# Altium schematic sheet Power_Regulators_Digital_4.SchDoc
size A4; DocumentNumber: 33; SheetNumber: 33; SheetTotal: 47
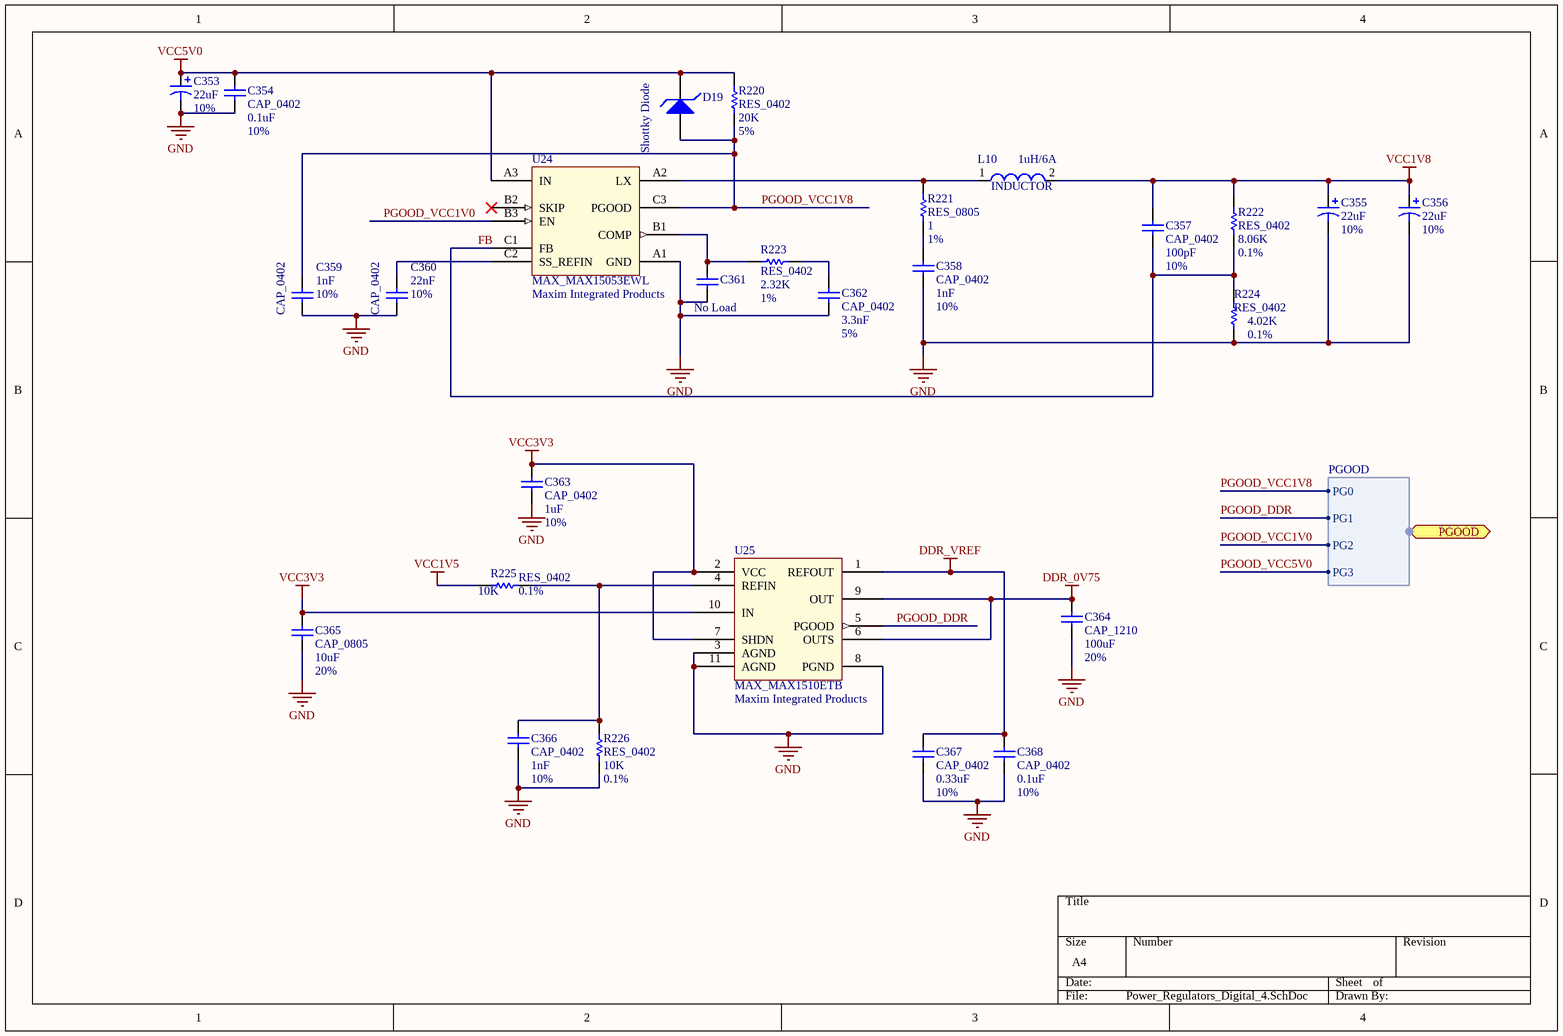
[diagram p0: Power_Regulators_Digital_4.SchDoc]

## Parts
C353  value 22uF  Tolerance: 10%  [Polarized_CAPC1210(3225)]  (hidden comment: Cap Pol1)
C354  CAP_0402  value 0.1uF  Tolerance: 10%  [CAPC0402(1005)60_N]
C355  value 22uF  Tolerance: 10%  [Polarized_CAPC1210(3225)]  (hidden comment: Cap Pol1)
C356  value 22uF  Tolerance: 10%  [Polarized_CAPC1210(3225)]  (hidden comment: Cap Pol1)
C357  CAP_0402  value 100pF  Tolerance: 10%  [CAPC0402(1005)60_N]
C358  CAP_0402  value 1nF  Tolerance: 10%  [CAPC0402(1005)60_N]
C359  CAP_0402  value 1nF  Tolerance: 10%  [CAPC0402(1005)60_N]
C360  CAP_0402  value 22nF  Tolerance: 10%  [CAPC0402(1005)60_N]
C361  value No Load  [CAPC0201(0603)33_N]  (hidden comment: CAP_0201)
C362  CAP_0402  value 3.3nF  Tolerance: 5%  [CAPC0402(1005)60_N]
C363  CAP_0402  value 1uF  Tolerance: 10%  [CAPC0402(1005)60_N]
C364  CAP_1210  value 100uF  Tolerance: 20%  [CAPC1210(3225)100_N]
C365  CAP_0805  value 10uF  Tolerance: 20%  [CAPC0805(2012)75_N]
C366  CAP_0402  value 1nF  Tolerance: 10%  [CAPC0402(1005)60_N]
C367  CAP_0402  value 0.33uF  Tolerance: 10%  [CAPC0402(1005)60_N]
C368  CAP_0402  value 0.1uF  Tolerance: 10%  [CAPC0402(1005)60_N]
D19  Shottky Diode  [SchottkyDiode_RB751S40_2-PIN]
L10  INDUCTOR  value 1uH/6A  [Inductor_SRN6045-Series_2-PIN]
R220  RES_0402  value 20K  Tolerance: 5%  [RESC0402(1005)_N]
R221  RES_0805  value 1  Tolerance: 1%  [RESC0805(2012)_N]
R222  RES_0402  value 8.06K  Tolerance: 0.1%  [RESC0402(1005)_N]
R223  RES_0402  value 2.32K  Tolerance: 1%  [RESC0402(1005)_N]
R224  RES_0402  value 4.02K  Tolerance: 0.1%  [RESC0402(1005)_N]
R225  RES_0402  value 10K  Tolerance: 0.1%  [RESC0402(1005)_N]
R226  RES_0402  value 10K  Tolerance: 0.1%  [RESC0402(1005)_N]
U24  MAX_MAX15053EWL  Manufacturer: Maxim Integrated Products  [MAX_MAX15053EWL_9WLP_W91E1Z+1]
U25  MAX_MAX1510ETB  Manufacturer: Maxim Integrated Products  [MAX_MAX1510ETB_10TDFN_T1033+1]

## Ports
PGOOD (harness PGOOD)

## Harnesses
PGOOD: PG0, PG1, PG2, PG3

## Nets
DDR_0V75: C364.2 U25.6(OUTS) U25.9(OUT)
DDR_VREF: C367.2 C368.2 U25.1(REFOUT)
GND: C353.2 C354.1 C355.2 C356.2 C358.1 C359.1 C360.1 C361.1 C362.1 C363.1 C364.1 C365.1 C366.1 C367.1 C368.1 R224.1 R226.1 U24.A1(GND) U25.3(AGND) U25.8(PGND) U25.11(AGND)
VCC1V5: R225.1
VCC1V8: C355.1 C356.1 C357.2 L10.2 R222.2
VCC3V3: C363.2 C365.2 U25.2(VCC) U25.7(SHDN) U25.10(IN)
VCC5V0: C353.1 C354.2 D19.1(K) R220.2 U24.A3(IN)
FB: C357.1 R222.1 R224.2 U24.C1(FB)
PGOOD_DDR: U25.5(PGOOD) ; port PGOOD.PG1
PGOOD_VCC1V0: U24.B3(EN) ; port PGOOD.PG2
PGOOD_VCC1V8: C359.2 D19.2(A) R220.1 U24.C3(PGOOD) ; port PGOOD.PG0
PGOOD_VCC5V0: port PGOOD.PG3
NetC358_2: C358.2 R221.1
NetC360_2: C360.2 U24.C2(SS_REFIN)
NetC361_2: C361.2 R223.1 U24.B1(COMP)
NetC362_2: C362.2 R223.2
NetC366_2: C366.2 R225.2 R226.2 U25.4(REFIN)
NetL10_1: L10.1 R221.2 U24.A2(LX)

Not connected (* = marked no-connect by the designer): U24 B2(SKIP)*

## Library data of the parts
C353 C355 C356 = TAJB226K006RNJ: 22uF, tantalum, 10% 6.3V, 1210; Manufacturer: AVX Corporation; Part Number: TAJB226K006RNJ; Footprint Ref: Polarized_CAPC1210(3225); Library Ref: Cap Pol1
C354 C368 = C1005X5R0J104K: 0.1uf, ceramic, 10%, 6.3V, X5R, 0402; Manufacturer: TDK Corporation; Part Number: C1005X5R0J104K; Footprint Ref: CAPC0402(1005)60_N; Library Ref: CAP_0402
C357 = 04026C101KAT2A: 100pF, ceramic, 10% 6.3V X7R, 0402; Manufacturer: AVX Corporation; Part Number: 04026C101KAT2A; Footprint Ref: CAPC0402(1005)60_N; Library Ref: CAP_0402
C358 C359 C366 = ECJ-0EB1E102K: 1000pF, ceramic, 10% 25V X7R, 0402; Manufacturer: Panasonic - ECG; Part Number: ECJ-0EB1E102K; Footprint Ref: CAPC0402(1005)60_N; Library Ref: CAP_0402
C360 = 0402YC223KAT2A: 0.022uF, ceramic, 10%, 16V, X7R, 0402; Manufacturer: AVX Corporation; Part Number: 0402YC223KAT2A; Footprint Ref: CAPC0402(1005)60_N; Library Ref: CAP_0402
C361 = No Load: Generic Capacitor; Tolerance: *; Part Number: No Load; Manufacturer: No Load; Footprint Ref: CAPC0201(0603)33_N; Library Ref: CAP_0201
C362 = LMK105SD332JV-F: 3300pF, ceramic 5% 10V, 0402; Manufacturer: Taiyo Yuden; Part Number: LMK105SD332JV-F; Footprint Ref: CAPC0402(1005)60_N; Library Ref: CAP_0402
C363 = C1005X5R0J105K: 1uF, ceramic, 10%, 6.3V, X5R, 0402; Manufacturer: TDK Corporation; Part Number: C1005X5R0J105K; Footprint Ref: CAPC0402(1005)60_N; Library Ref: CAP_0402
C364 = GRM32ER60J107ME20L: 100uF, ceramic, 20% 6.3V X5R, 1210; Manufacturer: Murata Electronics North America; Part Number: GRM32ER60J107ME20L; Footprint Ref: CAPC1210(3225)100_N; Library Ref: CAP_1210
C365 = ECJ-2FB0J106M: 10uF, ceramic, 20%, 6.3V, X5R 0805; Manufacturer: Panasonic - ECG; Part Number: ECJ-2FB0J106M; Footprint Ref: CAPC0805(2012)75_N; Library Ref: CAP_0805
C367 = C1005X5R1C334K: 0.33uF, ceramic, 10% 16V X5R, 0402; Manufacturer: TDK Corporation; Part Number: C1005X5R1C334K; Footprint Ref: CAPC0402(1005)60_N; Library Ref: CAP_0402
D19 = RB751S40: RB751S40, 40V 30mA schottky, SOD523F; Manufacturer: FAIRCHILD SEMICONDUCTOR; Part Number: RB751S40; Footprint Ref: SchottkyDiode_RB751S40_2-PIN; Library Ref: ShottkyDiode
L10 = SRN6045-1R0Y: SRN6045-1R0Y, 1uH 4.2A-8.5A, CDRH6D38; Manufacturer: Bourns; Tolerance: *; Part Number: SRN6045-1R0Y; Footprint Ref: Inductor_SRN6045-Series_2-PIN; Library Ref: INDUCTOR
R220 = ERJ-2GEJ203X: 20K ohm, 5%, 1/16W, 0402; Manufacturer: Panasonic - ECG; Part Number: ERJ-2GEJ203X; Footprint Ref: RESC0402(1005)_N; Library Ref: RES_0402
R221 = MCR10EZHFL1R00: 1 ohm, 1% 1/4W, 0805; Manufacturer: ROHM; Part Number: MCR10EZHFL1R00; Footprint Ref: RESC0805(2012)_N; Library Ref: RES_0805
R222 = 2-1879215-9: 8.06K ohm, 0.1% 1/16W, 0402; Manufacturer: TE Connectivity; Part Number: 2-1879215-9; Footprint Ref: RESC0402(1005)_N; Library Ref: RES_0402
R223 = ERJ-2RKF2321X: 2.32K ohm, 1% 1/16W, 0402; Manufacturer: Panasonic - ECG; Part Number: ERJ-2RKF2321X; Footprint Ref: RESC0402(1005)_N; Library Ref: RES_0402
R224 = RG1005P-4021-B-T5: 4.02K ohm, 0.1% 1/16W, 0402; Manufacturer: Susumu Co Ltd; Part Number: RG1005P-4021-B-T5; Footprint Ref: RESC0402(1005)_N; Library Ref: RES_0402
R225 R226 = ERA-2AEB103X: 10K ohm, 0.1% 1/16W, 0402; Manufacturer: Panasonic - ECG; Part Number: ERA-2AEB103X; Footprint Ref: RESC0402(1005)_N; Library Ref: RES_0402
U24 = MAX15053EWL+T: MAX15053EWL, 2A, Current-Mode Synchronous, Step-Down reg, WLP9; Part Number: MAX15053EWL+T; Footprint Ref: MAX_MAX15053EWL_9WLP_W91E1Z+1; Library Ref: MAX_MAX15053EWL
U25 = MAX1510ETB+T: MAX1510ETB, Low-Voltage, DDR Linear Regulators, DFN10; Part Number: MAX1510ETB+T; Footprint Ref: MAX_MAX1510ETB_10TDFN_T1033+1; Library Ref: MAX_MAX1510ETB